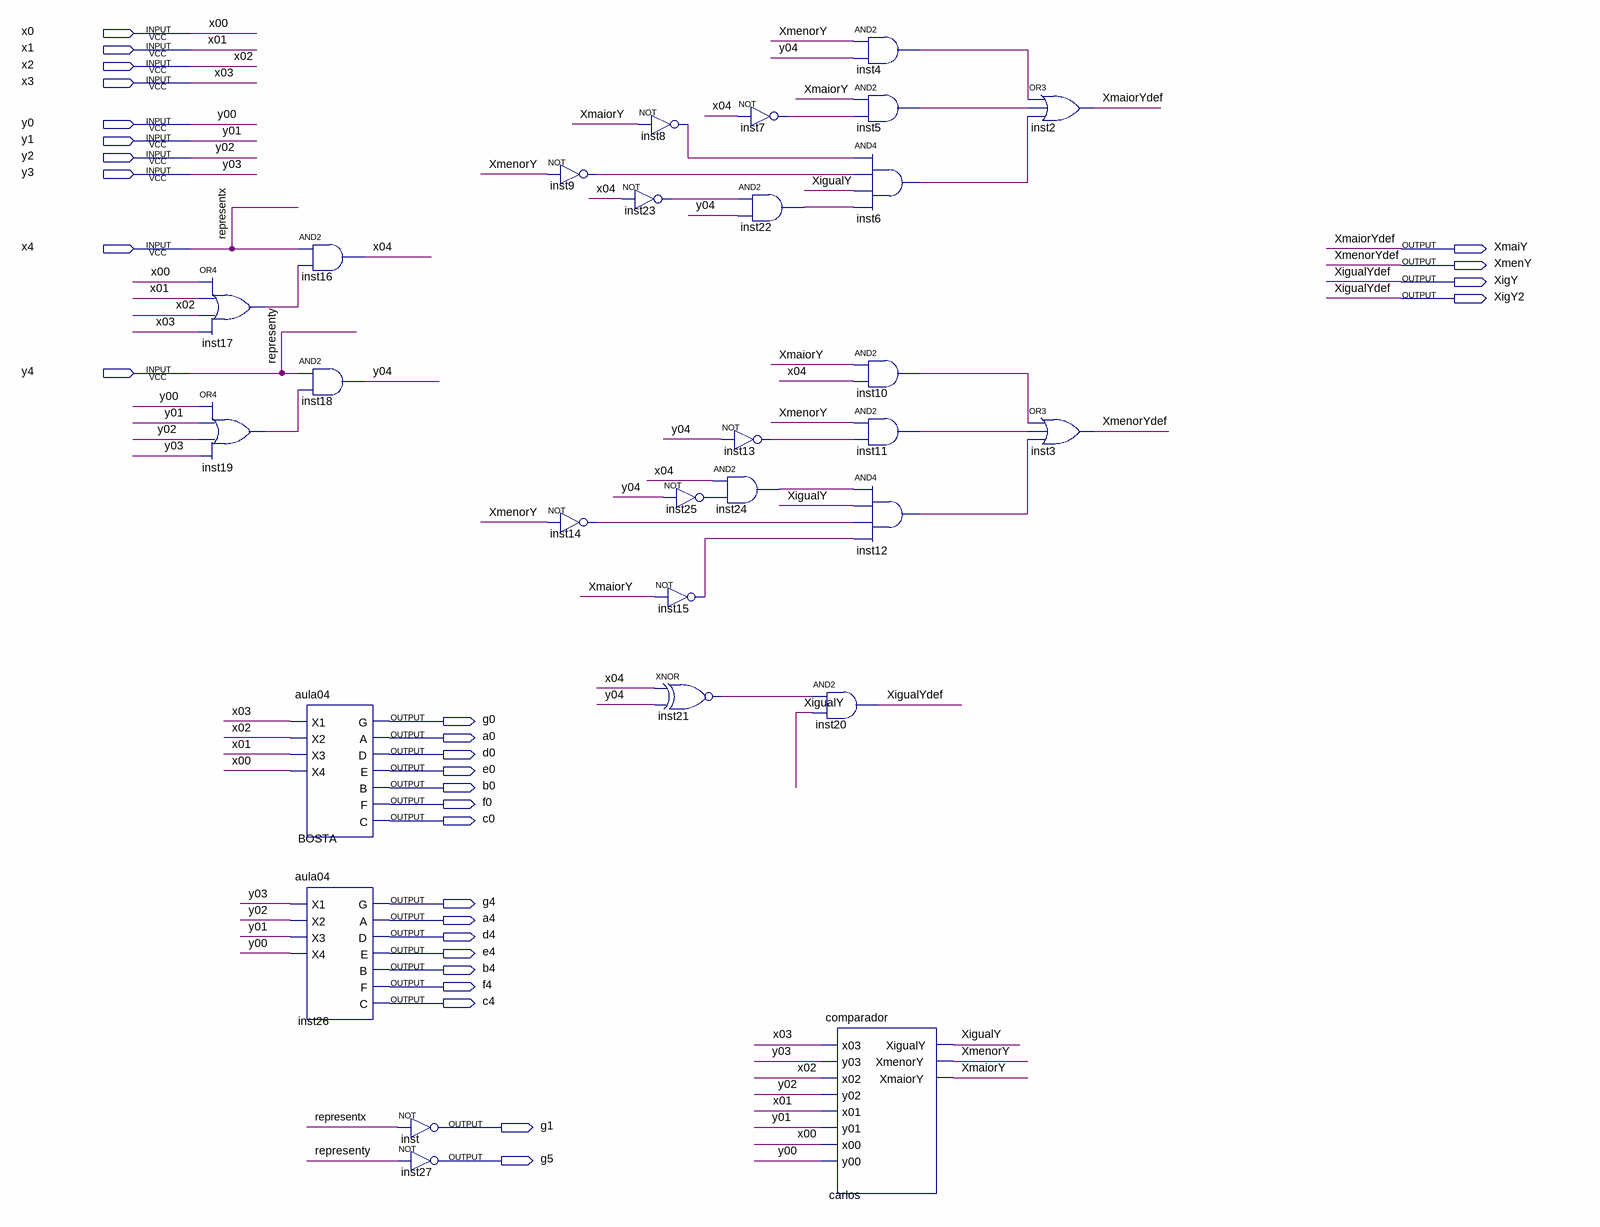
[diagram p0: schematic sheet]
// Quartus schematic aula13.bdf as structural Verilog: 29 symbols, 30 pins
module aula13 (
  input  x0,
  input  x1,
  input  x2,
  input  x3,
  input  y0,
  input  y1,
  input  y2,
  input  y3,
  input  x4,
  input  y4,
  output XmaiY,
  output XmenY,
  output XigY,
  output XigY2,
  output g0,
  output a0,
  output d0,
  output e0,
  output b0,
  output f0,
  output c0,
  output g4,
  output a4,
  output d4,
  output e4,
  output b4,
  output f4,
  output c4,
  output g1,
  output g5
);

  wire inst4_out, inst5_out, inst6_out, inst7_out, inst8_out, inst9_out, inst10_out, inst11_out, inst12_out,
       inst13_out, inst14_out, inst15_out, inst17_out, inst19_out, inst21_out, inst22_out, inst23_out,
       inst24_out, inst25_out, x04, XigualY, XmaiorY, XmenorY, y04;

  or inst17 (inst17_out, x0, x1, x2, x3);
  or inst19 (inst19_out, y0, y1, y2, y3);
  and inst16 (x04, x4, inst17_out);
  and inst18 (y04, y4, inst19_out);
  aula04 BOSTA (.X1(x3), .X2(x2), .X3(x1), .X4(x0), .G(g0), .A(a0), .D(d0), .E(e0), .B(b0), .F(f0), .C(c0));
  aula04 inst26 (.X1(y3), .X2(y2), .X3(y1), .X4(y0), .G(g4), .A(a4), .D(d4), .E(e4), .B(b4), .F(f4), .C(c4));
  not inst (g1, x4);
  not inst27 (g5, y4);
  not inst9 (inst9_out, XmenorY);
  not inst14 (inst14_out, XmenorY);
  not inst8 (inst8_out, XmaiorY);
  not inst23 (inst23_out, x04);
  not inst15 (inst15_out, XmaiorY);
  xnor inst21 (inst21_out, x04, y04);
  not inst13 (inst13_out, y04);
  and inst24 (inst24_out, x04, inst25_out);
  not inst25 (inst25_out, y04);
  not inst7 (inst7_out, x04);
  and inst22 (inst22_out, inst23_out, y04);
  and inst4 (inst4_out, XmenorY, y04);
  and inst5 (inst5_out, XmaiorY, inst7_out);
  and inst6 (inst6_out, inst8_out, inst9_out, XigualY, inst22_out);
  and inst10 (inst10_out, XmaiorY, x04);
  and inst11 (inst11_out, XmenorY, inst13_out);
  and inst12 (inst12_out, inst24_out, XigualY, inst14_out, inst15_out);
  and inst20 (XigY, inst21_out, XigualY);
  comparador carlos (
    .x03(x3), .y03(y3), .x02(x2), .y02(y2), .x01(x1), .y01(y1), .x00(x0), .y00(y0), .XigualY(XigualY),
    .XmenorY(XmenorY), .XmaiorY(XmaiorY));
  or inst2 (XmaiY, inst4_out, inst5_out, inst6_out);
  or inst3 (XmenY, inst10_out, inst11_out, inst12_out);

  assign XigY2 = XigY;

  // Other names for the same wires on the sheet: x00 = x0; x01 = x1; x02 = x2; x03 = x3; representx = x4;
  //   XigualYdef = XigY; XmaiorYdef = XmaiY; XmenorYdef = XmenY; y00 = y0; y01 = y1; y02 = y2; y03 = y3;
  //   representy = y4
endmodule
